# Altium schematic sheet GamePi_SCHEMATIC.SchDoc
size A4; SheetNumber: 1; SheetTotal: 5
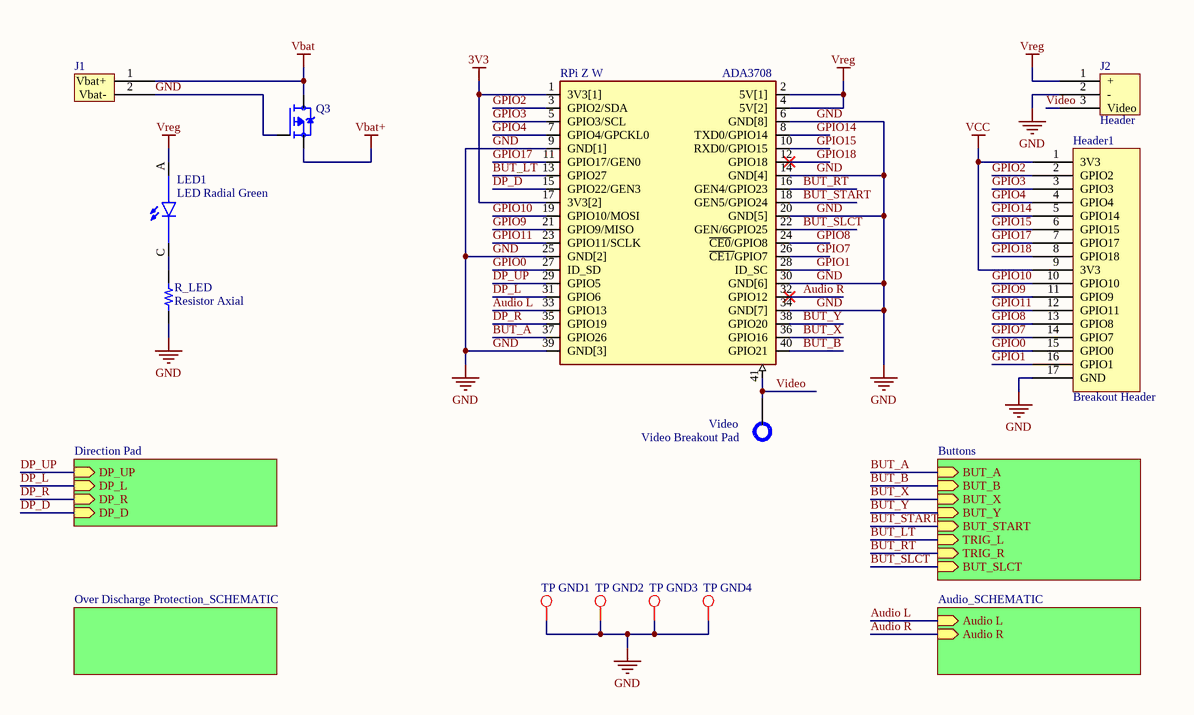
[diagram p0: GamePi_SCHEMATIC.SchDoc]

## Parts
Header1  Breakout Header  [Breakout Header]
J1  J?  [PS Header]  (value not drawn)
J2  Header  [Video Header]
LED1  LED Radial Green  [LED Radial Green]
Q3  NP15P04SLG  [NP15P04SLG]  (value not drawn)
R_LED  Resistor Axial  [Resistor Axial]
RPi_Z_W  ADA3708  [ADA3708_RPI-ZERO]
TP_GND1  Test Point  [Test Point]  (value not drawn)
TP_GND2  Test Point  [Test Point]  (value not drawn)
TP_GND3  Test Point  [Test Point]  (value not drawn)
TP_GND4  Test Point  [Test Point]  (value not drawn)
Video  Video Breakout Pad  [Video Breakout Pad]

## Sub-sheets
Audio_SCHEMATIC = Audio_SCHEMATIC.SchDoc: Audio L (in), Audio R (in)
Buttons = Buttons_SCHEMATIC.SchDoc: BUT_A (in), BUT_B (in), BUT_X (in), BUT_Y (in), BUT_START (in), TRIG_L (in), TRIG_R (in), BUT_SLCT (in)
Direction Pad = Direction Pad_SCHEMATIC.SchDoc: DP_UP (in), DP_L (in), DP_R (in), DP_D (in)
Over Discharge Protection_SCHEMATIC = Over Discharge Protection_SCHEMATIC.SchDoc: no entries

## Nets
3V3: RPi_Z_W.1(3V3[1]) RPi_Z_W.17(3V3[2])
GND: Header1.17(GND) J1.2(Vbat-) J2.2(-) Q3.1(G) R_LED.1 RPi_Z_W.6(GND[8]) RPi_Z_W.9(GND[1]) RPi_Z_W.14(GND[4]) RPi_Z_W.20(GND[5]) RPi_Z_W.25(GND[2]) RPi_Z_W.30(GND[6]) RPi_Z_W.34(GND[7]) RPi_Z_W.39(GND[3]) TP_GND1.TP?(Test_Point) TP_GND2.TP?(Test_Point) TP_GND3.TP?(Test_Point) TP_GND4.TP?(Test_Point)
Vbat: J1.1(Vbat+) Q3.4(D)
Vbat+: Q3.3(S)
VCC: Header1.1(3V3) Header1.9(3V3)
Vreg: J2.1(+) LED1.A RPi_Z_W.2(5V[1]) RPi_Z_W.4(5V[2])
Audio L: RPi_Z_W.33(GPIO13) ; sheet Audio_SCHEMATIC/Audio L
Audio R: RPi_Z_W.32(GPIO12) ; sheet Audio_SCHEMATIC/Audio R
BUT_A: RPi_Z_W.37(GPIO26) ; sheet Buttons/BUT_A
BUT_B: RPi_Z_W.40(GPIO21) ; sheet Buttons/BUT_B
BUT_LT: RPi_Z_W.13(GPIO27) ; sheet Buttons/TRIG_L
BUT_RT: RPi_Z_W.16(GEN4/GPIO23) ; sheet Buttons/TRIG_R
BUT_SLCT: RPi_Z_W.22(GEN/6GPIO25) ; sheet Buttons/BUT_SLCT
BUT_START: RPi_Z_W.18(GEN5/GPIO24) ; sheet Buttons/BUT_START
BUT_X: RPi_Z_W.36(GPIO16) ; sheet Buttons/BUT_X
BUT_Y: RPi_Z_W.38(GPIO20) ; sheet Buttons/BUT_Y
DP_D: RPi_Z_W.15(GPIO22/GEN3) ; sheet Direction Pad/DP_D
DP_L: RPi_Z_W.31(GPIO6) ; sheet Direction Pad/DP_L
DP_R: RPi_Z_W.35(GPIO19) ; sheet Direction Pad/DP_R
DP_UP: RPi_Z_W.29(GPIO5) ; sheet Direction Pad/DP_UP
GPIO0: Header1.15(GPIO0) RPi_Z_W.27(ID_SD)
GPIO1: Header1.16(GPIO1) RPi_Z_W.28(ID_SC)
GPIO2: Header1.2(GPIO2) RPi_Z_W.3(GPIO2/SDA)
GPIO3: Header1.3(GPIO3) RPi_Z_W.5(GPIO3/SCL)
GPIO4: Header1.4(GPIO4) RPi_Z_W.7(GPIO4/GPCKL0)
GPIO7: Header1.14(GPIO7) RPi_Z_W.26(~{CE1/}GPIO7)
GPIO8: Header1.13(GPIO8) RPi_Z_W.24(~{CE0}/GPIO8)
GPIO9: Header1.11(GPIO9) RPi_Z_W.21(GPIO9/MISO)
GPIO10: Header1.10(GPIO10) RPi_Z_W.19(GPIO10/MOSI)
GPIO11: Header1.12(GPIO11) RPi_Z_W.23(GPIO11/SCLK)
GPIO14: Header1.5(GPIO14) RPi_Z_W.8(TXD0/GPIO14)
GPIO15: Header1.6(GPIO15) RPi_Z_W.10(RXD0/GPIO15)
GPIO17: Header1.7(GPIO17) RPi_Z_W.11(GPIO17/GEN0)
GPIO18: Header1.8(GPIO18) RPi_Z_W.12(GPIO18)
Video: J2.3(Video) RPi_Z_W.41 Video.1
NetLED1_C: LED1.C R_LED.2

## Library data of the parts
J1 = PS Header
J2 = Video Header
RPi_Z_W = ADA3708: Raspberry Pi Zero WH (Zero W with Headers); MP: ADA3708; Availability: Unavailable; Package: None; Value: *; Price: None